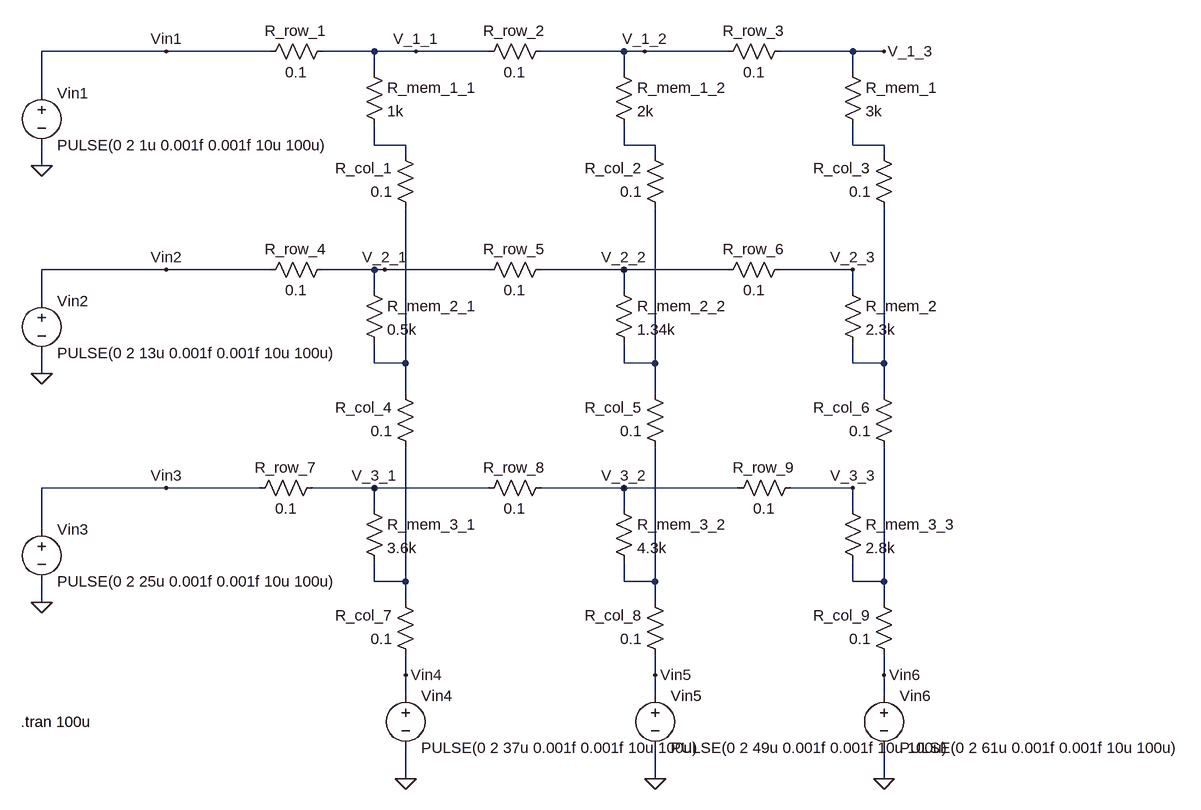
[diagram p0: schematic Memristor_full.asc]
Memristor_full.asc, the LTspice schematic file:
Version 4
SHEET 1 1876 1156
WIRE 256 16 64 16
WIRE 416 16 256 16
WIRE 576 16 496 16
WIRE 640 16 576 16
WIRE 752 16 640 16
WIRE 960 16 832 16
WIRE 992 16 960 16
WIRE 1120 16 992 16
WIRE 1312 16 1200 16
WIRE 1360 16 1312 16
WIRE 576 48 576 16
WIRE 960 48 960 16
WIRE 1312 48 1312 16
WIRE 64 80 64 16
WIRE 576 160 576 128
WIRE 624 160 576 160
WIRE 960 160 960 128
WIRE 1008 160 960 160
WIRE 1312 160 1312 128
WIRE 1360 160 1312 160
WIRE 624 176 624 160
WIRE 1008 176 1008 160
WIRE 1360 176 1360 160
WIRE 64 192 64 160
WIRE 256 352 64 352
WIRE 416 352 256 352
WIRE 576 352 496 352
WIRE 592 352 576 352
WIRE 752 352 592 352
WIRE 960 352 832 352
WIRE 1120 352 960 352
WIRE 1312 352 1200 352
WIRE 576 384 576 352
WIRE 960 384 960 352
WIRE 1312 384 1312 352
WIRE 64 400 64 352
WIRE 576 496 576 464
WIRE 624 496 624 256
WIRE 624 496 576 496
WIRE 960 496 960 464
WIRE 1008 496 1008 256
WIRE 1008 496 960 496
WIRE 1312 496 1312 464
WIRE 1360 496 1360 256
WIRE 1360 496 1312 496
WIRE 64 512 64 480
WIRE 624 544 624 496
WIRE 1008 544 1008 496
WIRE 1360 544 1360 496
WIRE 256 688 64 688
WIRE 400 688 256 688
WIRE 576 688 480 688
WIRE 752 688 576 688
WIRE 960 688 832 688
WIRE 1136 688 960 688
WIRE 1312 688 1216 688
WIRE 576 720 576 688
WIRE 960 720 960 688
WIRE 1312 720 1312 688
WIRE 64 752 64 688
WIRE 576 832 576 800
WIRE 624 832 624 624
WIRE 624 832 576 832
WIRE 960 832 960 800
WIRE 1008 832 1008 624
WIRE 1008 832 960 832
WIRE 1312 832 1312 800
WIRE 1360 832 1360 624
WIRE 1360 832 1312 832
WIRE 64 864 64 832
WIRE 624 864 624 832
WIRE 1008 864 1008 832
WIRE 1360 864 1360 832
WIRE 624 976 624 944
WIRE 1008 976 1008 944
WIRE 1360 976 1360 944
WIRE 624 1008 624 976
WIRE 1008 1008 1008 976
WIRE 1360 1008 1360 976
WIRE 624 1136 624 1088
WIRE 1008 1136 1008 1088
WIRE 1360 1136 1360 1088
FLAG 64 192 0
FLAG 64 512 0
FLAG 64 864 0
FLAG 624 1136 0
FLAG 1008 1136 0
FLAG 1360 1136 0
FLAG 256 16 Vin1
FLAG 256 352 Vin2
FLAG 256 688 Vin3
FLAG 624 976 Vin4
FLAG 1008 976 Vin5
FLAG 1360 976 Vin6
FLAG 640 16 V_1_1
FLAG 992 16 V_1_2
FLAG 1360 16 V_1_3
FLAG 592 352 V_2_1
FLAG 960 352 V_2_2
FLAG 1312 352 V_2_3
FLAG 576 688 V_3_1
FLAG 960 688 V_3_2
FLAG 1312 688 V_3_3
SYMBOL voltage 64 64 R0
WINDOW 123 0 0 Left 2
WINDOW 39 0 0 Left 2
SYMATTR InstName Vin1
SYMATTR Value PULSE(0 2 1u 0.001f 0.001f 10u 100u)
SYMBOL voltage 64 384 R0
WINDOW 123 0 0 Left 2
WINDOW 39 0 0 Left 2
SYMATTR InstName Vin2
SYMATTR Value PULSE(0 2 13u 0.001f 0.001f 10u 100u)
SYMBOL voltage 64 736 R0
WINDOW 123 0 0 Left 2
WINDOW 39 0 0 Left 2
SYMATTR InstName Vin3
SYMATTR Value PULSE(0 2 25u 0.001f 0.001f 10u 100u)
SYMBOL voltage 624 992 R0
WINDOW 123 0 0 Left 2
WINDOW 39 0 0 Left 2
SYMATTR InstName Vin4
SYMATTR Value PULSE(0 2 37u 0.001f 0.001f 10u 100u)
SYMBOL voltage 1008 992 R0
WINDOW 123 0 0 Left 2
WINDOW 39 0 0 Left 2
SYMATTR InstName Vin5
SYMATTR Value PULSE(0 2 49u 0.001f 0.001f 10u 100u)
SYMBOL voltage 1360 992 R0
WINDOW 123 0 0 Left 2
WINDOW 39 0 0 Left 2
SYMATTR InstName Vin6
SYMATTR Value PULSE(0 2 61u 0.001f 0.001f 10u 100u)
SYMBOL res 512 0 R90
WINDOW 0 0 56 VBottom 2
WINDOW 3 32 56 VTop 2
SYMATTR InstName R_row_1
SYMATTR Value 0.1
SYMBOL res 848 0 R90
WINDOW 0 0 56 VBottom 2
WINDOW 3 32 56 VTop 2
SYMATTR InstName R_row_2
SYMATTR Value 0.1
SYMBOL res 1216 0 R90
WINDOW 0 0 56 VBottom 2
WINDOW 3 32 56 VTop 2
SYMATTR InstName R_row_3
SYMATTR Value 0.1
SYMBOL res 512 336 R90
WINDOW 0 0 56 VBottom 2
WINDOW 3 32 56 VTop 2
SYMATTR InstName R_row_4
SYMATTR Value 0.1
SYMBOL res 848 336 R90
WINDOW 0 0 56 VBottom 2
WINDOW 3 32 56 VTop 2
SYMATTR InstName R_row_5
SYMATTR Value 0.1
SYMBOL res 1216 336 R90
WINDOW 0 0 56 VBottom 2
WINDOW 3 32 56 VTop 2
SYMATTR InstName R_row_6
SYMATTR Value 0.1
SYMBOL res 496 672 R90
WINDOW 0 0 56 VBottom 2
WINDOW 3 32 56 VTop 2
SYMATTR InstName R_row_7
SYMATTR Value 0.1
SYMBOL res 848 672 R90
WINDOW 0 0 56 VBottom 2
WINDOW 3 32 56 VTop 2
SYMATTR InstName R_row_8
SYMATTR Value 0.1
SYMBOL res 1232 672 R90
WINDOW 0 0 56 VBottom 2
WINDOW 3 32 56 VTop 2
SYMATTR InstName R_row_9
SYMATTR Value 0.1
SYMBOL res 640 272 R180
WINDOW 0 36 76 Left 2
WINDOW 3 36 40 Left 2
SYMATTR InstName R_col_1
SYMATTR Value 0.1
SYMBOL res 1024 272 R180
WINDOW 0 36 76 Left 2
WINDOW 3 36 40 Left 2
SYMATTR InstName R_col_2
SYMATTR Value 0.1
SYMBOL res 1376 272 R180
WINDOW 0 36 76 Left 2
WINDOW 3 36 40 Left 2
SYMATTR InstName R_col_3
SYMATTR Value 0.1
SYMBOL res 640 640 R180
WINDOW 0 36 76 Left 2
WINDOW 3 36 40 Left 2
SYMATTR InstName R_col_4
SYMATTR Value 0.1
SYMBOL res 1024 640 R180
WINDOW 0 36 76 Left 2
WINDOW 3 36 40 Left 2
SYMATTR InstName R_col_5
SYMATTR Value 0.1
SYMBOL res 1376 640 R180
WINDOW 0 36 76 Left 2
WINDOW 3 36 40 Left 2
SYMATTR InstName R_col_6
SYMATTR Value 0.1
SYMBOL res 640 960 R180
WINDOW 0 36 76 Left 2
WINDOW 3 36 40 Left 2
SYMATTR InstName R_col_7
SYMATTR Value 0.1
SYMBOL res 1024 960 R180
WINDOW 0 36 76 Left 2
WINDOW 3 36 40 Left 2
SYMATTR InstName R_col_8
SYMATTR Value 0.1
SYMBOL res 1376 960 R180
WINDOW 0 36 76 Left 2
WINDOW 3 36 40 Left 2
SYMATTR InstName R_col_9
SYMATTR Value 0.1
SYMBOL res 560 32 R0
SYMATTR InstName R_mem_1_1
SYMATTR Value 1k
SYMBOL res 944 32 R0
SYMATTR InstName R_mem_1_2
SYMATTR Value 2k
SYMBOL res 1296 32 R0
SYMATTR InstName R_mem_1
SYMATTR Value 3k
SYMBOL res 560 368 R0
SYMATTR InstName R_mem_2_1
SYMATTR Value 0.5k
SYMBOL res 944 368 R0
SYMATTR InstName R_mem_2_2
SYMATTR Value 1.34k
SYMBOL res 1296 368 R0
SYMATTR InstName R_mem_2
SYMATTR Value 2.3k
SYMBOL res 560 704 R0
SYMATTR InstName R_mem_3_1
SYMATTR Value 3.6k
SYMBOL res 944 704 R0
SYMATTR InstName R_mem_3_2
SYMATTR Value 4.3k
SYMBOL res 1296 704 R0
SYMATTR InstName R_mem_3_3
SYMATTR Value 2.8k
TEXT 32 1048 Left 2 !.tran 100u

The netlist it stands for:
* Memristor_full.asc
Vin1 Vin1 0 PULSE(0 2 1u 0.001f 0.001f 10u 100u)
Vin2 Vin2 0 PULSE(0 2 13u 0.001f 0.001f 10u 100u)
Vin3 Vin3 0 PULSE(0 2 25u 0.001f 0.001f 10u 100u)
Vin4 Vin4 0 PULSE(0 2 37u 0.001f 0.001f 10u 100u)
Vin5 Vin5 0 PULSE(0 2 49u 0.001f 0.001f 10u 100u)
Vin6 Vin6 0 PULSE(0 2 61u 0.001f 0.001f 10u 100u)
R_row_1 V_1_1 Vin1 0.1
R_row_2 V_1_2 V_1_1 0.1
R_row_3 V_1_3 V_1_2 0.1
R_row_4 V_2_1 Vin2 0.1
R_row_5 V_2_2 V_2_1 0.1
R_row_6 V_2_3 V_2_2 0.1
R_row_7 V_3_1 Vin3 0.1
R_row_8 V_3_2 V_3_1 0.1
R_row_9 V_3_3 V_3_2 0.1
R_col_1 N004 N001 0.1
R_col_2 N005 N002 0.1
R_col_3 N006 N003 0.1
R_col_4 N007 N004 0.1
R_col_5 N008 N005 0.1
R_col_6 N009 N006 0.1
R_col_7 Vin4 N007 0.1
R_col_8 Vin5 N008 0.1
R_col_9 Vin6 N009 0.1
R_mem_1_1 V_1_1 N001 1k
R_mem_1_2 V_1_2 N002 2k
R_mem_1 V_1_3 N003 3k
R_mem_2_1 V_2_1 N004 0.5k
R_mem_2_2 V_2_2 N005 1.34k
R_mem_2 V_2_3 N006 2.3k
R_mem_3_1 V_3_1 N007 3.6k
R_mem_3_2 V_3_2 N008 4.3k
R_mem_3_3 V_3_3 N009 2.8k
.tran 100u
.backanno
.end